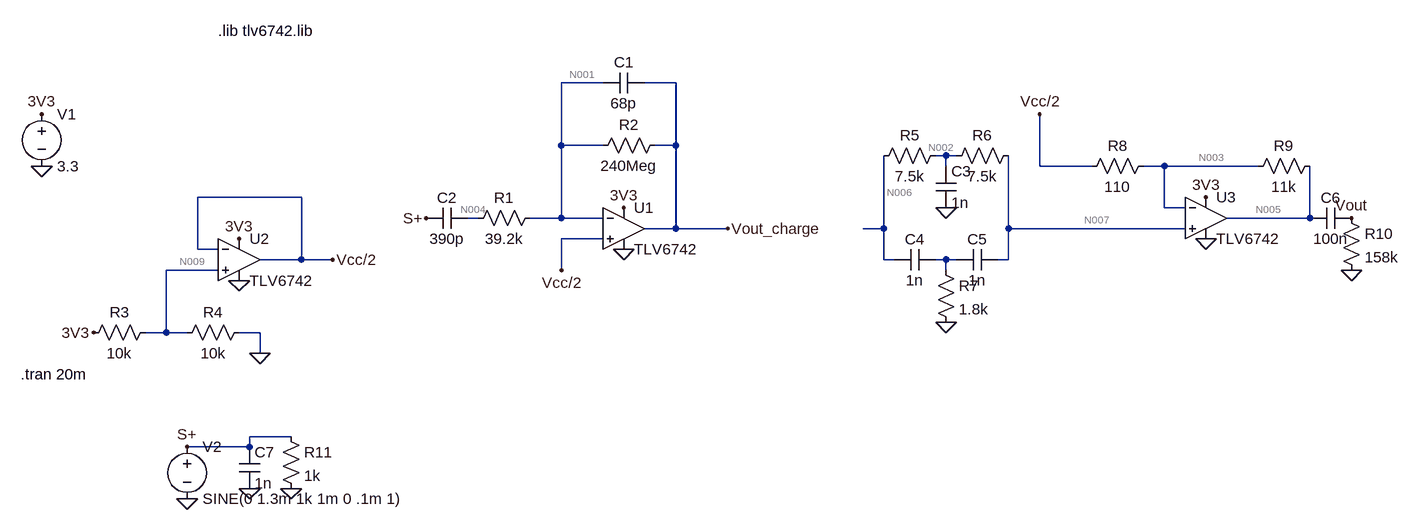
[diagram p0: schematic charge_amplifier.asc]
charge_amplifier.asc, the LTspice schematic file:
Version 4
SHEET 1 1472 680
WIRE 240 -48 176 -48
WIRE 352 -48 304 -48
WIRE 176 48 176 -48
WIRE 240 48 176 48
WIRE 352 48 352 -48
WIRE 352 48 320 48
WIRE 768 64 752 64
WIRE 784 64 768 64
WIRE 768 80 768 64
WIRE 912 80 912 0
WIRE 992 80 912 80
WIRE 1104 80 1072 80
WIRE 1248 80 1104 80
WIRE -224 128 -384 128
WIRE 1104 144 1104 80
WIRE 1136 144 1104 144
WIRE 48 160 32 160
WIRE 176 160 176 48
WIRE 176 160 128 160
WIRE 240 160 176 160
WIRE 1328 160 1328 80
WIRE 1328 160 1200 160
WIRE 352 176 352 48
WIRE 352 176 304 176
WIRE 432 176 352 176
WIRE 672 176 672 64
WIRE 672 176 640 176
WIRE 864 176 864 64
WIRE 1136 176 864 176
WIRE 240 192 176 192
WIRE -384 208 -384 128
WIRE -352 208 -384 208
WIRE -224 224 -224 128
WIRE -224 224 -288 224
WIRE -176 224 -224 224
WIRE 672 224 672 176
WIRE 688 224 672 224
WIRE 768 224 752 224
WIRE 784 224 768 224
WIRE 864 224 864 176
WIRE 864 224 848 224
WIRE -352 240 -432 240
WIRE 176 240 176 192
WIRE 768 240 768 224
WIRE -432 336 -432 240
WIRE -432 336 -464 336
WIRE -400 336 -432 336
WIRE -288 336 -320 336
WIRE -288 368 -288 336
WIRE -240 496 -304 496
WIRE -304 512 -304 496
WIRE -304 512 -400 512
FLAG -624 80 0
FLAG -624 0 3V3
FLAG 272 144 3V3
FLAG 272 208 0
FLAG -544 336 3V3
FLAG -288 368 0
FLAG 432 176 Vout_charge
FLAG -320 192 3V3
FLAG -320 256 0
FLAG -176 224 Vcc/2
FLAG 176 240 Vcc/2
FLAG -400 512 S+
FLAG -32 160 S+
FLAG 768 144 0
FLAG 1168 192 0
FLAG 1168 128 3V3
FLAG 912 0 Vcc/2
FLAG 1392 240 0
FLAG 1392 160 Vout
FLAG 768 320 0
FLAG -400 592 0
FLAG -304 576 0
FLAG -240 576 0
SYMBOL res 144 144 R90
WINDOW 0 0 56 VBottom 2
WINDOW 3 32 56 VTop 2
SYMATTR InstName R1
SYMATTR Value 39.2k
SYMBOL res 336 32 R90
WINDOW 0 0 56 VBottom 2
WINDOW 3 32 56 VTop 2
SYMATTR InstName R2
SYMATTR Value 240Meg
SYMBOL cap 304 -64 R90
WINDOW 0 0 32 VBottom 2
WINDOW 3 32 32 VTop 2
SYMATTR InstName C1
SYMATTR Value 68p
SYMBOL voltage -624 -16 R0
WINDOW 123 0 0 Left 0
WINDOW 39 0 0 Left 0
SYMATTR InstName V1
SYMATTR Value 3.3
SYMBOL res -448 320 R90
WINDOW 0 0 56 VBottom 2
WINDOW 3 32 56 VTop 2
SYMATTR InstName R3
SYMATTR Value 10k
SYMBOL res -304 320 R90
WINDOW 0 0 56 VBottom 2
WINDOW 3 32 56 VTop 2
SYMATTR InstName R4
SYMATTR Value 10k
SYMBOL OpAmps\\opamp2 272 112 R0
SYMATTR InstName U1
SYMATTR Value TLV6742
SYMBOL OpAmps\\opamp2 -320 160 R0
SYMATTR InstName U2
SYMATTR Value TLV6742
SYMBOL voltage -400 496 R0
WINDOW 123 0 0 Left 0
WINDOW 39 0 0 Left 0
SYMATTR InstName V2
SYMATTR Value SINE(0 1.3m 1k 1m 0 .1m 1)
SYMBOL cap 32 144 R90
WINDOW 0 0 32 VBottom 2
WINDOW 3 32 32 VTop 2
SYMATTR InstName C2
SYMATTR Value 390p
SYMBOL res 768 48 R90
WINDOW 0 0 56 VBottom 2
WINDOW 3 32 56 VTop 2
SYMATTR InstName R5
SYMATTR Value 7.5k
SYMBOL cap 752 80 R0
SYMATTR InstName C3
SYMATTR Value 1n
SYMBOL res 880 48 R90
WINDOW 0 0 56 VBottom 2
WINDOW 3 32 56 VTop 2
SYMATTR InstName R6
SYMATTR Value 7.5k
SYMBOL cap 752 208 R90
WINDOW 0 0 32 VBottom 2
WINDOW 3 32 32 VTop 2
SYMATTR InstName C4
SYMATTR Value 1n
SYMBOL cap 848 208 R90
WINDOW 0 0 32 VBottom 2
WINDOW 3 32 32 VTop 2
SYMATTR InstName C5
SYMATTR Value 1n
SYMBOL res 752 224 R0
SYMATTR InstName R7
SYMATTR Value 1.8k
SYMBOL OpAmps\\opamp2 1168 96 R0
SYMATTR InstName U3
SYMATTR Value TLV6742
SYMBOL res 1088 64 R90
WINDOW 0 0 56 VBottom 2
WINDOW 3 32 56 VTop 2
SYMATTR InstName R8
SYMATTR Value 110
SYMBOL res 1344 64 R90
WINDOW 0 0 56 VBottom 2
WINDOW 3 32 56 VTop 2
SYMATTR InstName R9
SYMATTR Value 11k
SYMBOL cap 1392 144 R90
WINDOW 0 0 32 VBottom 2
WINDOW 3 32 32 VTop 2
SYMATTR InstName C6
SYMATTR Value 100n
SYMBOL res 1376 144 R0
SYMATTR InstName R10
SYMATTR Value 158k
SYMBOL cap -320 512 R0
SYMATTR InstName C7
SYMATTR Value 1n
SYMBOL res -256 480 R0
SYMATTR InstName R11
SYMATTR Value 1k
TEXT -352 -128 Left 2 !.lib tlv6742.lib
TEXT -656 400 Left 2 !.tran 20m

The netlist it stands for:
* charge_amplifier.asc
R1 N001 N004 39.2k
R2 Vout_charge N001 240Meg
C1 Vout_charge N001 68p
V1 3V3 0 3.3
R3 N009 3V3 10k
R4 0 N009 10k
XU1 Vcc/2 N001 3V3 0 Vout_charge TLV6742  ; pins In+ In- V+ V- OUT
XU2 N009 Vcc/2 3V3 0 Vcc/2 TLV6742  ; pins In+ In- V+ V- OUT
V2 S+ 0 SINE(0 1.3m 1k 1m 0 .1m 1)
C2 N004 S+ 390p
R5 N002 N006 7.5k
C3 N002 0 1n
R6 N007 N002 7.5k
C4 N008 N006 1n
C5 N007 N008 1n
R7 N008 0 1.8k
XU3 N007 N003 3V3 0 N005 TLV6742  ; pins In+ In- V+ V- OUT
R8 N003 Vcc/2 110
R9 N005 N003 11k
C6 Vout N005 100n
R10 Vout 0 158k
C7 S+ 0 1n
R11 S+ 0 1k
.lib tlv6742.lib
.tran 20m
.backanno
.end

* Results of the author's LTspice run, read from the files saved beside the schematic
* Operating Point, zero values left out:
*   V(n001) = 1.65 V
*   V(n004) = 1.65 V
*   V(vout_charge) = 1.651 V
*   V(3v3) = 3.3 V
*   V(n009) = 1.65 V
*   V(vcc/2) = 1.65 V
*   V(n002) = 1.531 V
*   V(n006) = 1.531 V
*   V(n007) = 1.531 V
*   V(n005) = 9.956 mV
*   V(n003) = 1.634 V
*   I(R2) = 2.737 pA
*   I(R3) = -165 µA
*   I(R4) = -165 µA
*   I(R6) = -1.06 pA
*   I(R7) = -1.06 pA
*   I(R8) = -147.6 µA
*   I(R9) = -147.6 µA
*   I(R11) = 2.269 pA
*   I(V1) = -3.283 mA
*   I(V2) = -2.269 pA
*   Ix(u1:IN+) = 3.131 pA
*   Ix(u1:IN-) = 2.687 pA
*   Ix(u1:VCC) = 990 µA
*   Ix(u1:VEE) = -990 µA
*   Ix(u1:OUT) = -2.71 pA
*   Ix(u2:IN+) = 2.953 pA
*   Ix(u2:IN-) = 2.665 pA
*   Ix(u2:VCC) = 1.138 mA
*   Ix(u2:VEE) = -990 µA
*   Ix(u2:OUT) = -147.6 µA
*   Ix(u3:IN+) = 1.577 pA
*   Ix(u3:IN-) = 3.22 pA
*   Ix(u3:VCC) = 990 µA
*   Ix(u3:VEE) = -1.138 mA
*   Ix(u3:OUT) = 147.6 µA
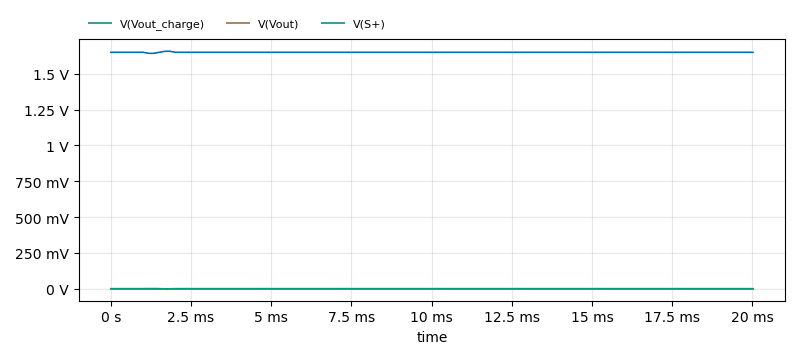
[diagram p1: Transient Analysis of charge_amplifier.asc, plotted from the saved traces]
* Transient Analysis, 1 run:
*   V(Vout_charge): min 1.644 V, max 1.658 V, average 1.651 V, rms 1.651 V, last 1.651 V
*   V(Vout): min -35.43 pV, max -15.9 pV, average -24.9 pV, rms 26.12 pV, last -15.9 pV
*   V(S+): min -1.299 mV, max 1.298 mV, average -7.022 nV, rms 205.8 µV, last 2.269 nV